# EAGLE design DMX Control Module (EAGLE 6.5.0)
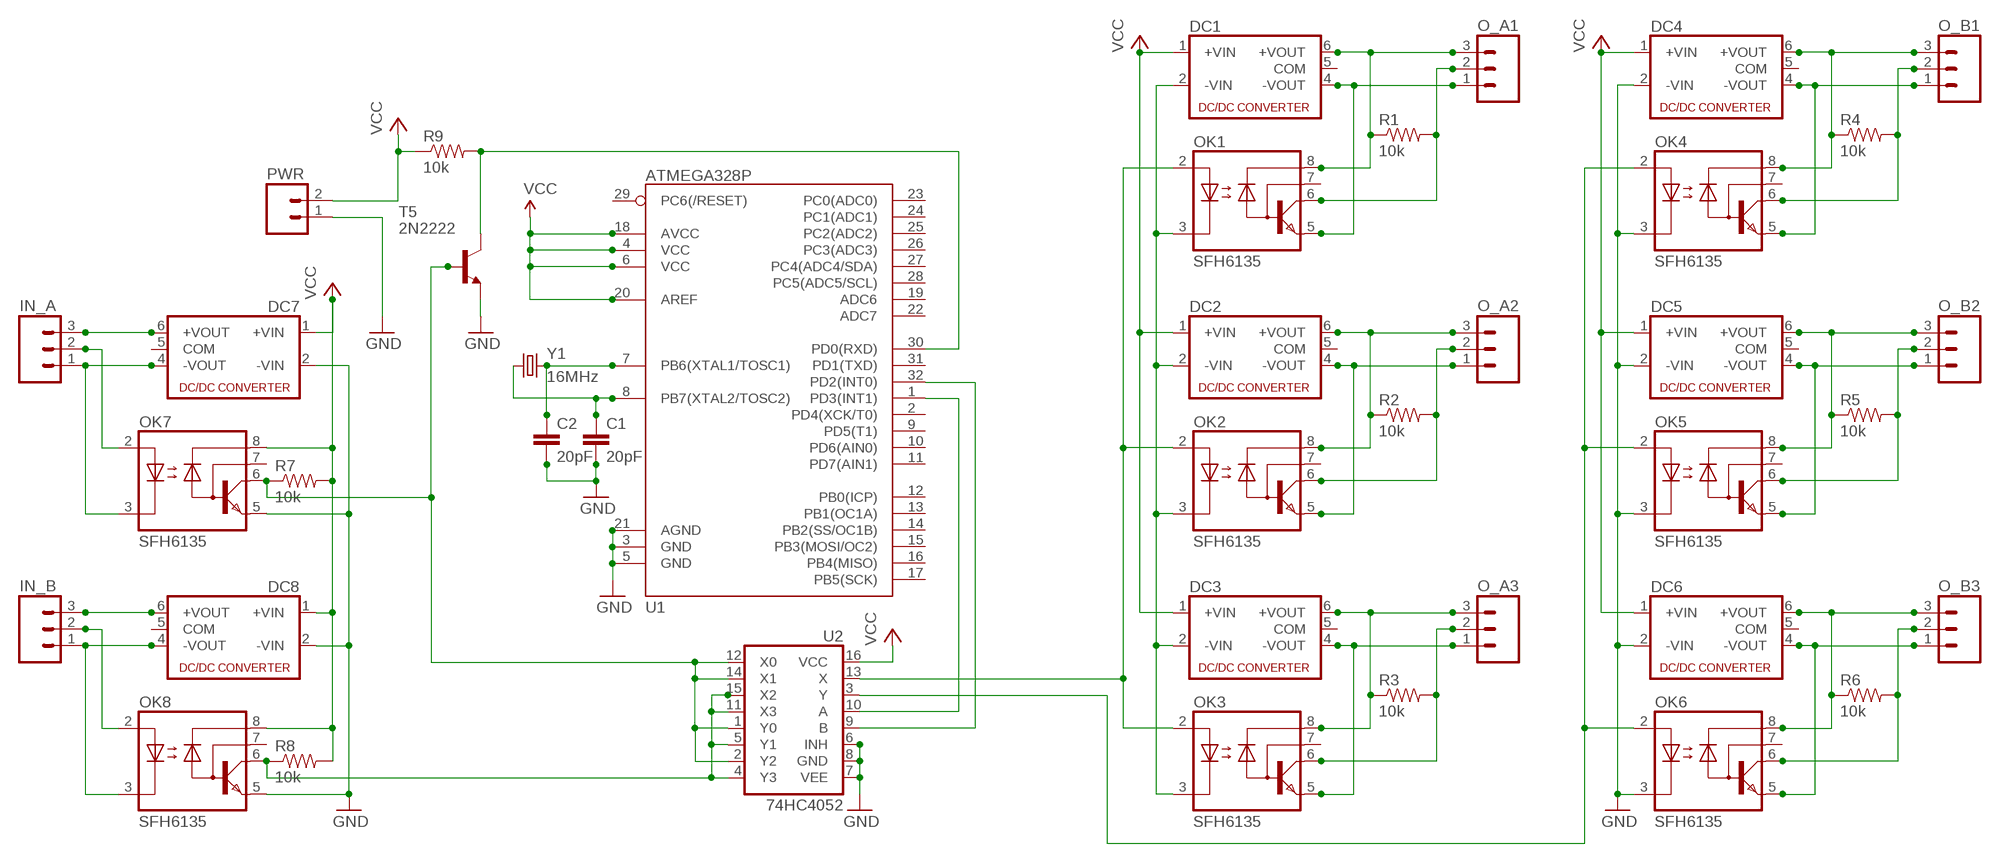
[diagram p0: schematic, sheet 1]

## Parts
C1  20pF  CAPPTH  [CAP-PTH-SMALL]
C2  20pF  CAPPTH  [CAP-PTH-SMALL]
DC1  NMA  [NMA]
DC2  NMA  [NMA]
DC3  NMA  [NMA]
DC4  NMA  [NMA]
DC5  NMA  [NMA]
DC6  NMA  [NMA]
DC7  NMA  [NMA]
DC8  NMA  [NMA]
IN_A  M03PTH  [1X03]
IN_B  M03PTH  [1X03]
O_A1  M03PTH  [1X03]
O_A2  M03PTH  [1X03]
O_A3  M03PTH  [1X03]
O_B1  M03PTH  [1X03]
O_B2  M03PTH  [1X03]
O_B3  M03PTH  [1X03]
OK1  SFH6135  6N135  [DIL08]
OK2  SFH6135  6N135  [DIL08]
OK3  SFH6135  6N135  [DIL08]
OK4  SFH6135  6N135  [DIL08]
OK5  SFH6135  6N135  [DIL08]
OK6  SFH6135  6N135  [DIL08]
OK7  SFH6135  6N135  [DIL08]
OK8  SFH6135  6N135  [DIL08]
PWR  M02PTH  [1X02]
R1  10k  RESISTORPTH-1/4W  [AXIAL-0.4]
R2  10k  RESISTORPTH-1/4W  [AXIAL-0.4]
R3  10k  RESISTORPTH-1/4W  [AXIAL-0.4]
R4  10k  RESISTORPTH-1/4W  [AXIAL-0.4]
R5  10k  RESISTORPTH-1/4W  [AXIAL-0.4]
R6  10k  RESISTORPTH-1/4W  [AXIAL-0.4]
R7  10k  RESISTORPTH-1/4W  [AXIAL-0.4]
R8  10k  RESISTORPTH-1/4W  [AXIAL-0.4]
R9  10k  RESISTORPTH-1/4W  [AXIAL-0.4]
T5  2N2222  -NPN-TO92  [TO92]
U1  ATMEGA328P  ATMEGA328_SMT  [TQFP32-08]
U2  74HC4052  74HC4052DIP  [DIL16]
Y1  16MHz  CRYSTALHC49US  [HC49US]

## Nets
GND: C1.2 C2.2 DC4.2(-VIN) DC5.2(-VIN) DC6.2(-VIN) DC7.2(-VIN) DC8.2(-VIN) OK4.3(C) OK5.3(C) OK6.3(C) OK7.5(GND) OK8.5(GND) PWR.1 T5.1(E) U1.3(GND) U1.5(GND) U1.21(AGND) U2.6(INH) U2.7(VEE) U2.8(GND)
N$1: C2.1 U1.7(PB6(XTAL1/TOSC1)) Y1.2
N$2: C1.1 U1.8(PB7(XTAL2/TOSC2)) Y1.1
N$3: DC1.6(+VOUT) O_A1.3 OK1.8(VCC) R1.P$1
N$4: DC1.4(-VOUT) O_A1.1 OK1.5(GND)
N$5: O_A1.2 OK1.6(VO) R1.P$2
N$6: DC2.6(+VOUT) O_A2.3 OK2.8(VCC) R2.P$1
N$7: DC2.4(-VOUT) O_A2.1 OK2.5(GND)
N$8: O_A2.2 OK2.6(VO) R2.P$2
N$9: DC3.6(+VOUT) O_A3.3 OK3.8(VCC) R3.P$1
N$10: DC3.4(-VOUT) O_A3.1 OK3.5(GND)
N$11: O_A3.2 OK3.6(VO) R3.P$2
N$12: DC4.6(+VOUT) O_B1.3 OK4.8(VCC) R4.P$1
N$13: DC4.4(-VOUT) O_B1.1 OK4.5(GND)
N$14: O_B1.2 OK4.6(VO) R4.P$2
N$15: OK7.6(VO) R7.P$1 T5.2(B) U2.1(Y0) U2.2(Y2) U2.12(X0) U2.14(X1)
N$16: DC5.4(-VOUT) O_B2.1 OK5.5(GND)
N$17: O_B2.2 OK5.6(VO) R5.P$2
N$18: DC6.6(+VOUT) O_B3.3 OK6.8(VCC) R6.P$1
N$19: DC6.4(-VOUT) O_B3.1 OK6.5(GND)
N$20: O_B3.2 OK6.6(VO) R6.P$2
N$21: DC1.2(-VIN) DC2.2(-VIN) DC3.2(-VIN) OK1.3(C) OK2.3(C) OK3.3(C)
N$22: OK8.6(VO) R8.P$1 U2.4(Y3) U2.5(Y1) U2.11(X3) U2.15(X2)
N$23: U1.32(PD2(INT0)) U2.9(B)
N$24: U1.1(PD3(INT1)) U2.10(A)
N$25: DC7.6(+VOUT) IN_A.3
N$26: DC7.4(-VOUT) IN_A.1 OK7.3(C)
N$27: IN_A.2 OK7.2(A)
N$28: DC8.6(+VOUT) IN_B.3
N$29: DC8.4(-VOUT) IN_B.1 OK8.3(C)
N$30: IN_B.2 OK8.2(A)
N$32: R9.P$2 T5.3(C) U1.30(PD0(RXD))
N$36: OK1.2(A) OK2.2(A) OK3.2(A) U2.13(X)
N$38: OK4.2(A) OK5.2(A) OK6.2(A) U2.3(Y)
O_B2: DC5.6(+VOUT) O_B2.3 OK5.8(VCC) R5.P$1
VCC: DC1.1(+VIN) DC2.1(+VIN) DC3.1(+VIN) DC4.1(+VIN) DC5.1(+VIN) DC6.1(+VIN) DC7.1(+VIN) DC8.1(+VIN) OK7.8(VCC) OK8.8(VCC) PWR.2 R7.P$2 R8.P$2 R9.P$1 U1.4(VCC) U1.6(VCC) U1.18(AVCC) U1.20(AREF) U2.16(VCC)
Unconnected: DC1.5(COM) DC2.5(COM) DC3.5(COM) DC4.5(COM) DC5.5(COM) DC6.5(COM) DC7.5(COM) DC8.5(COM) OK1.7(VB) OK2.7(VB) OK3.7(VB) OK4.7(VB) OK5.7(VB) OK6.7(VB) OK7.7(VB) OK8.7(VB) U1.2(PD4(XCK/T0)) U1.9(PD5(T1)) U1.10(PD6(AIN0)) U1.11(PD7(AIN1)) U1.12(PB0(ICP)) U1.13(PB1(OC1A)) U1.14(PB2(SS/OC1B)) U1.15(PB3(MOSI/OC2)) U1.16(PB4(MISO)) U1.17(PB5(SCK)) U1.19(ADC6) U1.22(ADC7) U1.23(PC0(ADC0)) U1.24(PC1(ADC1)) U1.25(PC2(ADC2)) U1.26(PC3(ADC3)) U1.27(PC4(ADC4/SDA)) U1.28(PC5(ADC5/SCL)) U1.29(PC6(/RESET)) U1.31(PD1(TXD))

## Library data of the parts
C1 C2 = SparkFun-Capacitors:CAP: Capacitor Standard 0603 ceramic capacitor, and 0.1" leaded capacitor.
DC1-DC8 = dc-dc-converter:NMA: DC-DC CONVERTER; MF: C & D TECHNOLOGIES, INC; MPN: NMA0515SC; OC_FARNELL: 1021434; OC_NEWARK: 61K3064
IN_A IN_B O_A1-O_A3 O_B1-O_B3 = SparkFun-Connectors:M03: Header 3 Standard 3-pin 0.1" header. Use with straight break away headers (SKU : PRT-00116), right angle break away headers (PRT-00553), swiss pins (PRT-00743), machine pins (PRT-00117), and female headers (PRT-00115). Molex polarized connector foot print use with SKU : PRT-08232 with associated crimp pins and housings.
OK1-OK8 = optocoupler:6N135: MOTOROLA OPTO COUPLER; MF: FAIRCHILD SEMICONDUCTOR; MPN: 6N135; OC_FARNELL: 1021342; OC_NEWARK: 58K9658
PWR = SparkFun-Connectors:M02: Standard 2-pin 0.1" header. Use with - straight break away headers ( PRT-00116) - right angle break away headers (PRT-00553) - swiss pins (PRT-00743) - machine pins (PRT-00117) - female headers (PRT-00115) Molex polarized connector foot print use with: PRT-08233 with associated crimp pins and housings. 2.54_SCREWTERM for use with PRT-10571. 3.5mm Screw Terminal footprints for PRT-08084 5mm Screw Terminal footprints for use with PRT-08433
R1-R9 = SparkFun-Passives:RESISTOR: Resistor Basic schematic elements and footprints for 0603, 1206, and PTH resistors.
T5 = transistor:*-NPN-: NPN Transistror BF959 corrected 2008.03.06
U1 = SparkFun-DigitalIC:ATMEGA328_SMT: 32-Pin Atmega328 part Commonly used on Arduino compatible boards Available in QFP and QFN packages TQFP is IC-09069 QFN is non-stock; PROD_ID: IC-09069
U2 = SparkFun-AnalogIC:74HC4052: Dual 4:1 analog mux
Y1 = SparkFun-FreqCtrl:CRYSTAL: Various standard crystals. Proven footprints. Spark Fun Electronics SKU : COM-00534

## Board
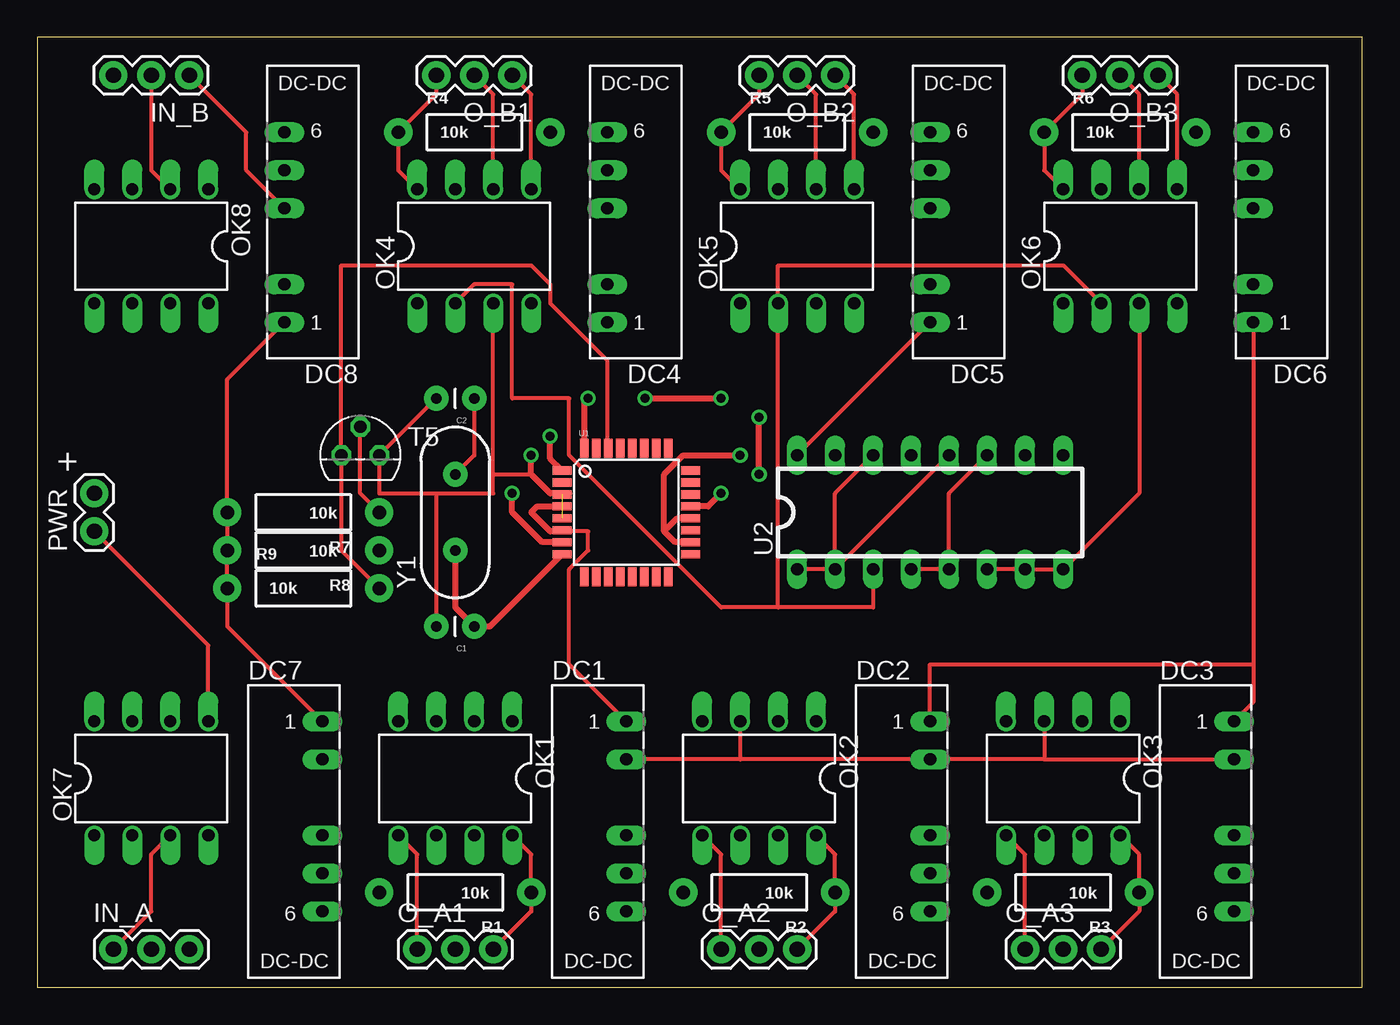
[diagram p1: board, top side]
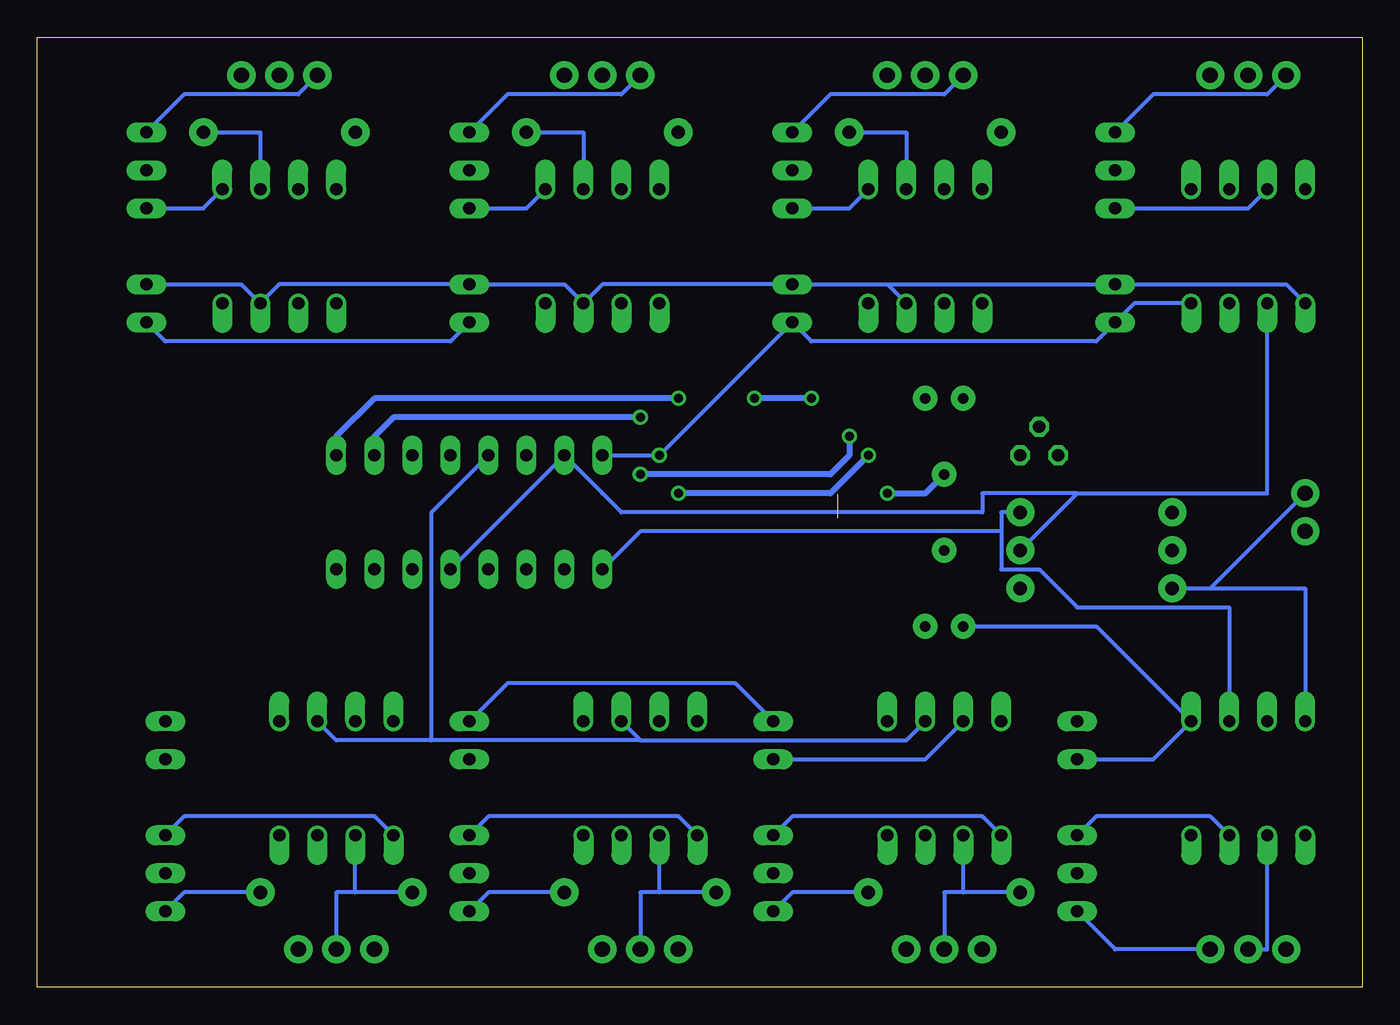
[diagram p2: board, bottom side, seen from below]

Size 88.57 x 63.49 mm. Coordinates in mm from the lower left corner, seen from the top.
Outline: 0,0 88.57,0 88.57,63.49 0,63.49 0,0
Copper layers (1*16): Top 0.035mm / dielectric 1.5mm / Bottom 0.035mm
Design rules "default": minimum track width 10mil, minimum drill 24mil, track to track 8mil, track to pad 8mil, pad to pad 8mil, via to via 8mil, smd to smd 8mil, copper to edge 40mil, drill to drill 8mil, minimum pad ring 10mil, minimum via ring 8mil, stop-mask expansion 4mil, vias tented up to drill 0mil, thermal gap 10mil

### Footprints (pad centres in the part's own frame; a part is rotated, then mirrored left to right if it is on the bottom)
CAP-PTH-SMALL = drill 0.7 pad 1.651: 1 0,0; 2 2.54,0
NMA = drill 0.813 long: 1 0,6.35; 2 0,3.81; 4 0,-1.27; 5 0,-3.81; 6 0,-6.35
1X03 = drill 1.016 pad 1.88: 1 0,0; 2 2.54,0; 3 5.08,0
DIL08 = drill 0.813 offset: 1 -3.81,-3.81; 2 -1.27,-3.81; 3 1.27,-3.81; 4 3.81,-3.81; 5 3.81,3.81; 6 1.27,3.81; 7 -1.27,3.81; 8 -3.81,3.81
1X02 = drill 1.016 pad 1.88: 1 0,0; 2 2.54,0
AXIAL-0.4 = drill 0.9 pad 1.88: P$1 -5.08,0; P$2 5.08,0
TO92 = drill 0.813 octagon: 1 1.27,0; 2 0,1.905; 3 -1.27,0
TQFP32-08 = smd 1.27 x 0.559: 1 -4.293,2.8; 2 -4.293,2; 3 -4.293,1.2; 4 -4.293,0.4; 5 -4.293,-0.4; 6 -4.293,-1.2; 7 -4.293,-2; 8 -4.293,-2.8; 17 4.293,-2.8; 18 4.293,-2; 19 4.293,-1.2; 20 4.293,-0.4; 21 4.293,0.4; 22 4.293,1.2; 23 4.293,2; 24 4.293,2.8 | smd 0.559 x 1.27: 9 -2.8,-4.293; 10 -2,-4.293; 11 -1.2,-4.293; 12 -0.4,-4.293; 13 0.4,-4.293; 14 1.2,-4.293; 15 2,-4.293; 16 2.8,-4.293; 25 2.8,4.293; 26 2,4.293; 27 1.2,4.293; 28 0.4,4.293; 29 -0.4,4.293; 30 -1.2,4.293; 31 -2,4.293; 32 -2.8,4.293
DIL16 = drill 0.813 long: 1 -8.89,-3.81; 2 -6.35,-3.81; 3 -3.81,-3.81; 4 -1.27,-3.81; 5 1.27,-3.81; 6 3.81,-3.81; 7 6.35,-3.81; 8 8.89,-3.81; 9 8.89,3.81; 10 6.35,3.81; 11 3.81,3.81; 12 1.27,3.81; 13 -1.27,3.81; 14 -3.81,3.81; 15 -6.35,3.81; 16 -8.89,3.81
HC49US = drill 0.7 pad 1.651: 1 -2.54,0; 2 2.54,0

### Placement (x,y rotation side)
C1  29.21,24.13 180 top
C2  29.21,39.37 180 top
DC1  39.37,11.43 0 top
DC2  59.69,11.43 0 top
DC3  80.01,11.43 0 top
DC4  38.1,50.8 180 top
DC5  59.69,50.8 180 top
DC6  81.28,50.8 180 top
DC7  19.05,11.43 0 top
DC8  16.51,50.8 180 top
IN_A  5.08,2.54 0 top
IN_B  10.16,60.96 180 top
O_A1  25.4,2.54 0 top
O_A2  45.72,2.54 0 top
O_A3  66.04,2.54 0 top
O_B1  31.75,60.96 180 top
O_B2  53.34,60.96 180 top
O_B3  74.93,60.96 180 top
OK1  27.94,13.97 180 top
OK2  48.26,13.97 180 top
OK3  68.58,13.97 180 top
OK4  29.21,49.53 0 top
OK5  50.8,49.53 0 top
OK6  72.39,49.53 0 top
OK7  7.62,13.97 0 top
OK8  7.62,49.53 180 top
PWR  3.81,30.48 90 top
R1  27.94,6.35 180 top
R2  48.26,6.35 180 top
R3  68.58,6.35 180 top
R4  29.21,57.15 0 top
R5  50.8,57.15 0 top
R6  72.39,57.15 0 top
R7  17.78,31.75 180 top
R8  17.78,29.21 180 top
R9  17.78,26.67 0 top
T5  21.59,35.56 0 top
U1  39.37,31.75 0 top
U2  59.69,31.75 0 top
Y1  27.94,31.75 90 top

### Tracks (layer width: path | path; a pad name or v marks a point on that pad's centre or on a via)
GND  (via drill 0.6)  (1 unrouted)
  Top 0.254: U2.6 U2.7 U2.8 73.66,33.02 OK6.3 | PWR.1 11.43,22.86 OK7.5 | 26.67,33.02 22.86,33.02 T5.1 C2.2 | 26.67,33.02 30.48,33.02 30.48,34.29 | 30.48,34.29 33.02,34.29 | 35.56,33.02 U1.3 | 26.67,33.02 C1.2 | 30.48,34.29 OK4.3
  Top 0.406: 35.56,33.02 34.29,33.02 33.02,34.29 v33.02,35.56 | v45.72,33.02 44.85,32.15 U1.21
  Bottom 0.254: DC6.2 74.93,46.99 OK6.3 72.39,46.99 DC5.2 53.34,46.99 OK5.3 50.8,46.99 DC4.2 31.75,46.99 | DC7.2 13.97,15.24 OK7.5 17.78,24.13 C1.2 | OK8.5 5.08,46.99 DC8.2 31.75,46.99 | 31.75,46.99 OK4.3
  Bottom 0.406: v33.02,35.56 35.56,33.02 v45.72,33.02
N$1  (via drill 0.6)
  Top 0.254: Y1.2 29.21,35.56 C2.1
  Top 0.406: U1.7 33.75,29.75 31.75,31.75 v31.75,33.02
  Bottom 0.406: v31.75,33.02 29.21,33.02 Y1.2
N$2
  Top 0.406: Y1.1 27.94,25.4 C1.1 30.26,24.13 U1.8
N$3
  Top 0.254: OK1.8 33.02,8.89 R1.P$1 33.02,5.08 O_A1.3
  Bottom 0.254: DC1.6 38.1,6.35 R1.P$1
N$4
  Top 0.254: OK1.5 25.4,8.89 O_A1.1
  Bottom 0.254: DC1.4 38.1,11.43 25.4,11.43 OK1.5
N$5
  Bottom 0.254: 26.67,6.35 OK1.6 | R1.P$2 26.67,6.35 | O_A1.2 27.94,6.35 26.67,6.35
N$6
  Top 0.254: OK2.8 53.34,8.89 R2.P$1 53.34,5.08 O_A2.3
  Bottom 0.254: DC2.6 58.42,6.35 R2.P$1
N$7
  Top 0.254: OK2.5 45.72,8.89 O_A2.1
  Bottom 0.254: DC2.4 58.42,11.43 45.72,11.43 OK2.5
N$8
  Bottom 0.254: 46.99,6.35 OK2.6 | R2.P$2 46.99,6.35 | O_A2.2 48.26,6.35 46.99,6.35
N$9
  Top 0.254: OK3.8 73.66,8.89 R3.P$1 73.66,5.08 O_A3.3
  Bottom 0.254: DC3.6 78.74,6.35 R3.P$1
N$10
  Top 0.254: OK3.5 66.04,8.89 O_A3.1
  Bottom 0.254: DC3.4 78.74,11.43 66.04,11.43 OK3.5
N$11
  Bottom 0.254: 67.31,6.35 OK3.6 | R3.P$2 67.31,6.35 | O_A3.2 68.58,6.35 67.31,6.35
N$12
  Top 0.254: OK4.8 24.13,54.61 R4.P$1 26.67,59.69 O_B1.3
  Bottom 0.254: DC4.6 35.56,59.69 27.94,59.69 O_B1.3
N$13
  Top 0.254: O_B1.1 33.02,59.69 OK4.5
  Bottom 0.254: OK4.5 34.29,52.07 DC4.4
N$14
  Top 0.254: O_B1.2 30.48,59.69 OK4.6
  Bottom 0.254: OK4.6 30.48,57.15 R4.P$2
N$15
  Top 0.254: U2.2 U2.1 | U2.14 53.34,33.02 U2.2 | U2.2 U2.12 | T5.2 21.59,33.02 R7.P$1
  Bottom 0.254: OK7.6 8.89,25.4 19.05,25.4 21.59,27.94 24.13,27.94 24.13,30.48 | 24.13,30.48 24.13,31.75 R7.P$1 | U2.1 48.26,30.48 24.13,30.48
N$16
  Top 0.254: O_B2.1 54.61,59.69 OK5.5
  Bottom 0.254: OK5.5 55.88,52.07 DC5.4
N$17
  Top 0.254: O_B2.2 52.07,59.69 OK5.6
  Bottom 0.254: OK5.6 52.07,57.15 R5.P$2
N$18
  Top 0.254: OK6.8 67.31,54.61 R6.P$1 69.85,59.69 O_B3.3
  Bottom 0.254: DC6.6 78.74,59.69 71.12,59.69 O_B3.3
N$19
  Top 0.254: O_B3.1 76.2,59.69 OK6.5
  Bottom 0.254: OK6.5 77.47,52.07 DC6.4
N$20
  Top 0.254: O_B3.2 73.66,59.69 OK6.6
  Bottom 0.254: OK6.6 73.66,57.15 R6.P$2
N$21
  Top 0.254: 46.99,15.24 DC1.2 | OK2.3 46.99,15.24 | 67.31,15.24 DC2.2 46.99,15.24 | OK3.3 67.31,15.24 | 67.31,15.24 DC3.2
  Bottom 0.254: OK1.3 29.21,15.24 DC1.2
N$22
  Top 0.254: U2.4 U2.5 60.96,33.02 U2.11
  Bottom 0.254: U2.5 U2.15 50.8,33.02 49.53,31.75 25.4,31.75 25.4,33.02 19.05,33.02 | OK8.6 6.35,33.02 19.05,33.02 | R8.P$1 19.05,33.02
N$23  (via drill 0.6)
  Top 0.406: U1.32 36.57,39.11 v36.83,39.37 | v40.64,39.37 v45.72,39.37
  Bottom 0.406: v36.83,39.37 v40.64,39.37 | v45.72,39.37 66.04,39.37 68.58,36.83 U2.9
N$24  (via drill 0.6)
  Top 0.406: U1.1 34.29,35.34 v34.29,36.83 | v48.26,34.29 v48.26,38.1
  Bottom 0.406: v34.29,36.83 34.29,35.56 35.56,34.29 v48.26,34.29 | v48.26,38.1 64.77,38.1 66.04,36.83 U2.10
N$25
  Bottom 0.254: DC7.6 16.51,2.54 IN_A.3
N$26
  Top 0.254: OK7.3 7.62,8.89 7.62,5.08 IN_A.1
  Bottom 0.254: DC7.4 17.78,11.43 10.16,11.43 OK7.3
N$27
  Bottom 0.254: OK7.2 6.35,2.54 IN_A.2
N$28
  Bottom 0.254: DC8.6 13.97,59.69 6.35,59.69 IN_B.3
N$29
  Top 0.254: IN_B.1 13.97,57.15 13.97,54.61 DC8.4
  Bottom 0.254: OK8.3 7.62,52.07 DC8.4
N$30
  Top 0.254: OK8.2 7.62,54.61 IN_B.2
N$32
  Top 0.254: U1.30 38.1,35.56 38.1,41.91 34.29,45.72 34.29,46.99 33.02,48.26 20.32,48.26 T5.3 20.32,29.21 R9.P$2
N$36
  Bottom 0.254: OK1.2 30.48,16.51 48.26,16.51 | OK2.2 48.26,16.51 | OK3.2 68.58,16.51 62.23,16.51 | 48.26,16.51 62.23,16.51 | U2.13 62.23,31.75 62.23,16.51
N$38
  Top 0.254: OK4.2 29.21,46.99 31.75,46.99 31.75,39.37 35.56,39.37 35.56,35.56 45.72,25.4 49.53,25.4 | 49.53,25.4 55.88,25.4 U2.3 | 49.53,25.4 OK5.2 49.53,48.26 68.58,48.26 OK6.2
O_B2
  Top 0.254: OK5.8 45.72,54.61 R5.P$1 48.26,59.69 O_B2.3
  Bottom 0.254: DC5.6 57.15,59.69 49.53,59.69 O_B2.3
VCC  (via drill 0.6)
  Top 0.254: DC3.1 81.28,19.05 81.28,21.59 | DC6.1 81.28,21.59 | DC1.1 35.56,21.59 35.56,27.94 36.83,29.21 36.83,30.48 35.56,30.48 U1.6 | 81.28,21.59 59.69,21.59 DC2.1 | DC5.1 U2.16 | DC7.1 12.7,24.13 R9.P$1 R8.P$2 R7.P$2 12.7,40.64 DC8.1
  Top 0.406: U1.18 42.64,29.75 41.91,30.48 | U1.20 42.78,31.35 41.91,30.48 | 41.91,30.48 41.91,34.29 43.18,35.56 v46.99,35.56 | U1.6 35.01,30.48 34.29,30.48 33.02,31.75 33.42,32.15 U1.4
  Bottom 0.254: DC2.1 57.15,20.32 41.91,20.32 DC1.1 | U2.16 v46.99,35.56 DC4.1 36.83,43.18 17.78,43.18 DC8.1 15.24,45.72 OK8.8 | OK7.8 3.81,26.67 10.16,26.67 | R9.P$1 10.16,26.67 | 10.16,26.67 PWR.2 | DC6.1 80.01,43.18 60.96,43.18 DC5.1

### Text on the board
tNames: +